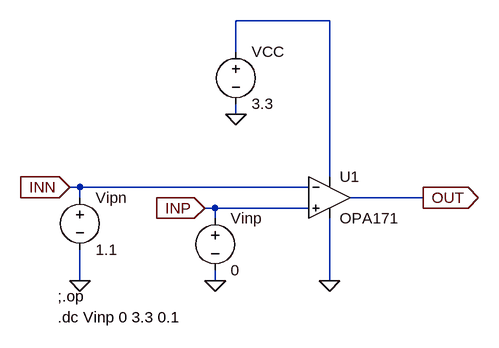
[diagram p0: schematic opa171_test.asc]
* opa171_test.asc
* U1: OPA171 (symbol mysym\OPA171 not available, pins judged from their places): In+=INP In-=INN V+=N001 V-=0 OUT=OUT
VCC N001 0 3.3
Vinp INP 0 0
Vipn INN 0 1.1
;.op
.dc Vinp 0 3.3 0.1
.backanno
.end

* Results of the author's LTspice run, read from the files saved beside the schematic
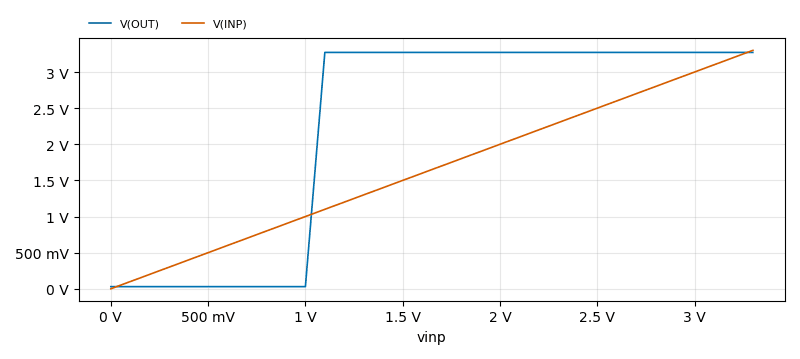
[diagram p1: DC transfer characteristic of opa171_test.asc, plotted from the saved traces]
* DC transfer characteristic, 1 run:
*   V(OUT): 29.92 mV at vinp=0 V, 3.272 V at vinp=3.3 V, min 29.92 mV, max 3.272 V
*   V(INP): 0 V at vinp=0 V, 3.3 V at vinp=3.3 V, min 0 V, max 3.3 V